# Altium schematic sheet USB-UART.SchDoc
size 420 x 297 mm; SheetNumber: 3; SheetTotal: 5; ProjectTitle: Prj name
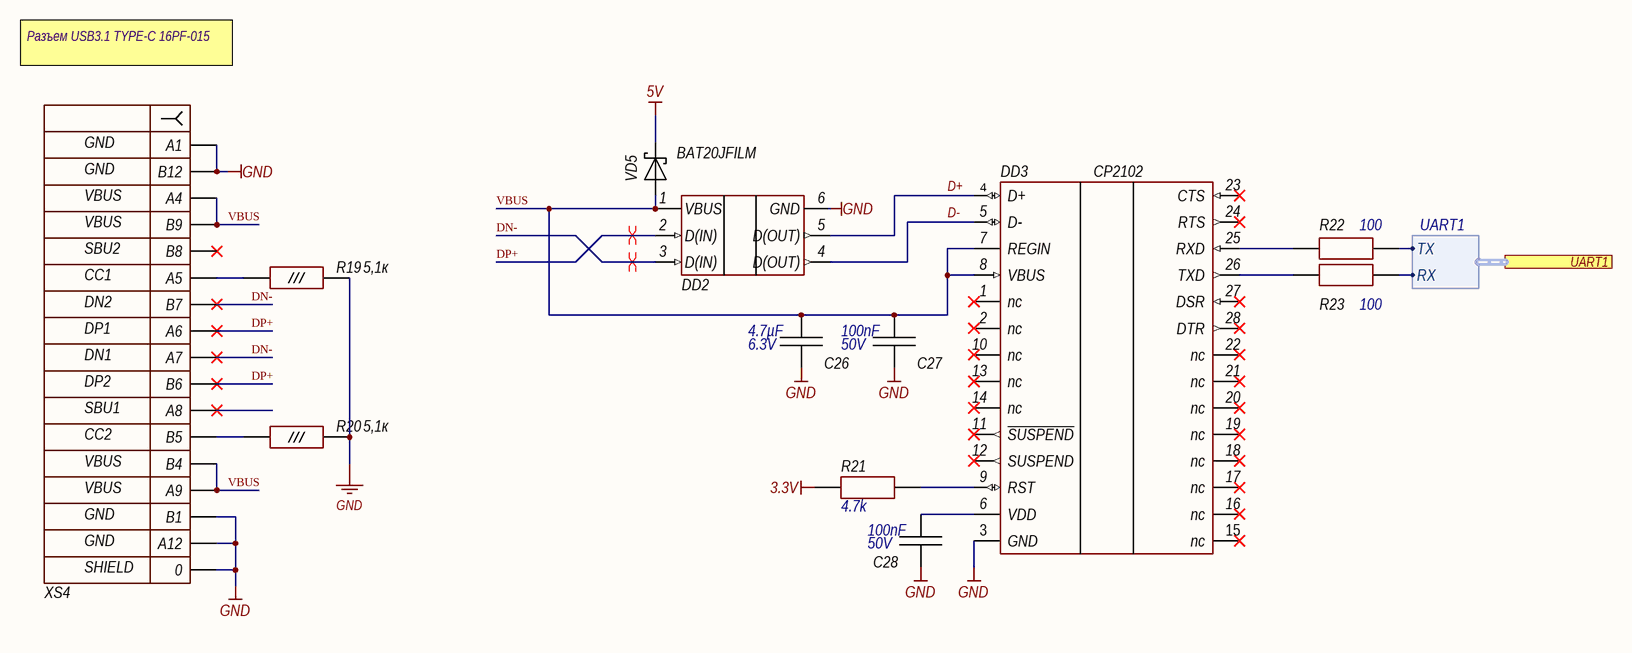
[diagram p0: USB-UART.SchDoc]

## Parts
C26  Voltage Rating: 6.3V  Capacitance: 4.7µF  [CAPC0603_H0.90_N]  (hidden comment: CC0603KRX7R5BB475)
C27  Capacitance: 100nF  Voltage Rating: 50V  [CAPC0603_H0.90_N]  (hidden comment: CC0603KRX7R7BB104)
C28  Capacitance: 100nF  Voltage Rating: 50V  [CAPC0603_H0.90_N]  (hidden comment: CC0603KRX7R7BB104)
DD2  STF202-22T1G  [TSOP-6]  (value not drawn)
DD3  CP2102  [QFN50P500X500X90_HS-29N]  (no BOM)
R19  5,1к  [RESC0402_N]
R20  5,1к  [RESC0402_N]
R21  Resistance: 4.7k  [RESC0603_N]  (hidden comment: RC0603FR-074K7L)
R22  Resistance: 100  [RESC0603_N]  (hidden comment: RC0603FR-07100RL)
R23  Resistance: 100  [RESC0603_N]  (hidden comment: RC0603FR-07100RL)
VD5  BAT20JFILM  [SOD-323]  (no BOM)
XS4  16pf-015  [XS_16PF-015]  (value not drawn)

## Ports
UART1 (harness UART1)

## Harnesses
UART1: RX, TX

## Nets
3.3V: R21.1
5V: VD5.2
GND: C26.2 C27.2 C28.2 DD2.6(GND) DD3.3(GND) R19.2 R20.2 XS4.0 XS4.1(A1) XS4.2(B12) XS4.15(B1) XS4.16(A12)
D+: DD2.5(D(OUT)) DD3.4(D+)
D-: DD2.4(D(OUT)) DD3.5(D-)
DN-: DD2.3(D(IN)) XS4.7(B7) XS4.9(A7)
DP+: DD2.2(D(IN)) XS4.8(A6) XS4.10(B6)
VBUS: C26.1 C27.1 DD2.1(VBUS) DD3.7(REGIN) DD3.8(VBUS) VD5.1 XS4.3(A4) XS4.4(B9) XS4.13(B4) XS4.14(A9)
NetC28_1: C28.1 DD3.6(VDD)
NetDD3_9: DD3.9(RST) R21.2
NetDD3_25: DD3.25(RXD) R22.1
NetDD3_26: DD3.26(TXD) R23.1
NetR19_1: R19.1 XS4.6(A5)
NetR20_1: R20.1 XS4.12(B5)
NetR22_2: R22.2 ; port UART1.TX
NetR23_2: R23.2 ; port UART1.RX

Not connected (* = marked no-connect by the designer): DD3 1(nc)* 2(nc)* 10(nc)* 11(~{SUSPEND})* 12(SUSPEND)* 13(nc)* 14(nc)* 15(nc)* 16(nc)* 17(nc)* 18(nc)* 19(nc)* 20(nc)* 21(nc)* 22(nc)* 23(CTS)* 24(RTS)* 27(DSR)* 28(DTR)*; XS4 5(B8)* 11(A8)*

## Layout directives
differential pair: DN-, DP+

## Notes on the sheet
- Разъем USB3.1 TYPE-C 16PF-015
- Title:
- Author:
- Approved:
- Size:
- Date:
- Git Hash:
- A3
- Prj:
- Sheet
- of
- SW Version:
- Variant:
- Edited:
- CONFIDENTIAL
- File:
- (in symbol CMP-CON-USB-0008-1) GND; VBUS; SBU2; CC1; DN2; DP1; DN1; DP2; SBU1; CC2; SHIELD

## Library data of the parts
C26 = CMP-CAP-CER-SMD-0033-1: 4.7uF 10% X7R 0603; Manufacturer: Yageo; Tolerance: 10%; Series: CC; Height: 800µm; Dielectric: X7R; Case Code (Metric): 1608; Length: 1.6mm; Case Code (Imperial): 0603; Max Operating Temperature: 125°C; Author: v.ivanchenko; Manufacturer Part Number: CC0603KRX7R5BB475; Min Operating Temperature: -55°C; Depth: 800µm; Lead Free: Lead Free; HelpURL: https://www.yageo.com/upload/media/product/products/datasheet/mlcc/UPY-GPHC_X7R_6.3V-to-50V_20.pdf; Case/Package: 0603
C27 C28 = CMP-CAP-CER-SMD-0036-1: 0.1uF 10% X7R 50V 0603; Manufacturer: Yageo; Length: 1.6mm; Min Operating Temperature: -55°C; Case Code (Metric): 1608; Case Code (Imperial): 0603; Author: v.ivanchenko; Tolerance: 10%; Case/Package: 0603; Depth: 800µm; Manufacturer Part Number: CC0603KRX7R7BB104; HelpURL: https://www.yageo.com/upload/media/product/products/datasheet/mlcc/UPY-GPHC_X7R_6.3V-to-50V_20.pdf; Max Operating Temperature: 125°C; Lead Free: Lead Free; Height: 800µm; Dielectric: X7R; Series: CC
DD2 = STF202-22T1G_ON Semiconductor: DD STF202-22T1G USB Filter with ESD protection; Voltage: 5,0 В; ValueBOM: Микросхема STF202-22T1G TSOP−6; Marking: S22; Автор: Коваль Максим; Количество1: 1; Цена1: 0.2926; Количество2: 2343; Цена2: 0.1986; Разрешен к применению: True; Type_BOM: Микросхема; HelpURL: https://www.onsemi.com/pub/Collateral/STF202-22T1-D.PDF; PartNumber: STF202-22T1G_ON Semiconductor; ManufacturerPartNumber: STF202-22T1G; Manufacturer: ON Semiconductor; Value: STF202-22T1G; ComponentLink3Description: Datasheet; Modify: 14.01.2019 15:51:31; Supplier: Compel; Supplier P/N: STF202-22T1G; Package: TSOP-6; ВП: Микросхема STF202-22T1G TSOP−6; ComponentLink4URL: https://sds.compel.ru/search?q=STF202-22T1G; ComponentLink5URL: https://www.chipdip.by/search?searchtext=STF202-22T1G; ComponentLink6URL: https://belchip.by/search_fuzzy/?query=STF202-22T1G; ComponentLink4Description: Compel; ComponentLink5Description: Chip-Dip; ComponentLink6Description: Belchip; Package_BOM: TSOP-6; Package Description: TSOP-6; SMD mounting: True; ComponentLink1Description: Supplier; ComponentLink1URL: http://www.compel.ru; ComponentLink2Description: Manufacturer Link; ComponentLink2URL: http://www.onsemi.ru.com/; Type: DD
DD3 = CP2102_Silicon Labs: DD CP2102 SINGLE-CHIP USB-TO-UART BRIDGE; ValueBOM: Микросхема  CP2102; Автор: Касперович Андрей; Количество1: 1; Цена1: 3.2; Количество2: 10000; Цена2: 2.95; Разрешен к применению: True; Package_BOM: QFN28; Type_BOM: Микросхема; HelpURL: https://www.silabs.com/documents/public/data-sheets/CP2102-9.pdf; PartNumber: CP2102_Silicon Labs; ManufacturerPartNumber: CP2102; Manufacturer: Silicon Labs; Value: CP2102; ComponentLink3Description: Datasheet; Modify: 20.11.2018 8:18:00; Supplier: Compel; Package: QFN50P500X500X90_HS-29N; ВП: Микросхема  CP2102; ComponentLink4URL: https://sds.compel.ru/search?q=CP2102; ComponentLink5URL: https://www.chipdip.by/search?searchtext=CP2102; ComponentLink6URL: https://belchip.by/search_fuzzy/?query=CP2102; ComponentLink4Description: Compel; ComponentLink5Description: Chip-Dip; ComponentLink6Description: Belchip; Package Description: QFN50P500X500X90_HS-29N; SMD mounting: True; ComponentLink1Description: Supplier; ComponentLink1URL: http://www.compel.ru; ComponentLink2Description: Manufacturer Link; ComponentLink2URL: http://www.silabs.com/; Type: DD
R19 R20 = RC0402FR-075K1L_Yageo: RES 5k1 SMD 0402 1%; Manufacturer: Yageo; Power: 0,1 Вт; ValueBOM: Резистор RC0402FR-075K1L "Yageo" (5,1 кОм ± 1 %, 0,1 Вт SMD 0402); ТКС: ±100ppm/C°; Автор: Анципов Антон; Количество1: 1; Цена1: 0,0011; Количество2: 50000; Цена2: 0,0010; Разрешен к применению: True; Type_BOM: Резистор; PartNumber: RC0402FR-075K1L_Yageo; HelpURL: http://www.yageo.com/documents/recent/PYu-RC0402_51_RoHS_L_6.pdf; ManufacturerPartNumber: RC0402FR-075K1L; ComponentLink3Description: Datasheet; Value: 5,1к; Tolerance: ± 1 %; ComponentLink2Description: Manufacturer Link; ComponentLink2URL: http://www.yageo.com/; Operating Temperature: -55°C ~ +155°C; Modify: 09.02.2021 18:51:35; Supplier: Compel; Supplier P/N: RC0402FR-075K1L; Package Description: SMD 0402; Package: RESC0402; Type: R; ComponentLink4URL: https://sds.compel.ru/search?q=RC0402FR-075K1L; ComponentLink5URL: https://www.chipdip.by/search?searchtext=RC0402FR-075K1L; ComponentLink6URL: https://belchip.by/search_fuzzy/?query=RC0402FR-075K1L; ComponentLink4Description: Compel; ComponentLink5Description: Chip-Dip; ComponentLink6Description: Belchip; Package_BOM: SMD 0402
R21 = CMP-RES-SMD-0429-2: RES SMD 4,7 KOHM 1% 1/10W 0603; Manufacturer: Yageo; Max Power Dissipation: 100mW; Temperature Coefficient: ±100ppm/C°; Voltage Rating: 75V; Author: M.S. Koval; Case/Package: 0603; HelpURL: https://www.yageo.com/upload/media/product/productsearch/datasheet/rchip/PYu-RC_Group_51_RoHS_L_11.pdf; Manufacturer Part Number: RC0603FR-074K7L; Max Operating Temperature: 155°C; Min Operating Temperature: -55°C; Tolerance: 1%
R22 R23 = CMP-RES-SMD-0389-2: RES SMD 100 OHM 1% 1/10W 0603; Manufacturer: Yageo; Max Power Dissipation: 100mW; Temperature Coefficient: ±100ppm/C°; Voltage Rating: 75V; Author: M.S. Koval; Case/Package: 0603; HelpURL: https://www.yageo.com/upload/media/product/productsearch/datasheet/rchip/PYu-RC_Group_51_RoHS_L_11.pdf; Manufacturer Part Number: RC0603FR-07100RL; Max Operating Temperature: 155°C; Min Operating Temperature: -55°C; Tolerance: 1%
VD5 = BAT20JFILM_STMicroelectronics: DIODE SCHOTTKY 23V 1A; Voltage: 23 В; Current: 1 А; ValueBOM: Диод BAT20JFILM "STMicroelectronics" SOD-323; Marking: 20; Автор: Селедцов Михаил; Количество1: 1; Цена1: 0.32; Количество2: 1000; Цена2: 0.0612; Разрешен к применению: True; ВП: Диод BAT20JFILM SOD-323; Type: VD; Type_BOM: Диод; HelpURL: https://www.st.com/resource/en/datasheet/bat20j.pdf; PartNumber: BAT20JFILM_STMicroelectronics; ManufacturerPartNumber: BAT20JFILM; Manufacturer: STMicroelectronics; Value: BAT20JFILM; Operating Temperature: -65°C ~ +150°C; ComponentLink3Description: Datasheet; Modify: 26.03.2020 17:26:51; Supplier: Digi-Key; Supplier P/N: 497-3381-1-ND; Package: SOD-323; ComponentLink4URL: https://www.digikey.com/product-detail/en/stmicroelectronics/BAT20JFILM/497-3381-1-ND/669138; ComponentLink5URL: https://www.chipdip.by/search?searchtext=STPS0560Z; ComponentLink6URL: https://sds.compel.ru/infosheet/ST/BAT20JFILM; ComponentLink4Description: Digi-Key; ComponentLink5Description: Chip-Dip; ComponentLink6Description: Compel; Package_BOM: SOD-323; Package Description: SOD-323; SMD mounting: True; ComponentLink1Description: Supplier; ComponentLink1URL: http://www.digikey.com; ComponentLink2Description: Manufacturer Link; ComponentLink2URL: http://www.st.com
XS4 = CMP-CON-USB-0008-1: USB3.1 TYPEC 16P SMD RA; Manufacturer: JAE; Gender: Female; Current Rating: 5A; USB Standard: USB 3.2; Number of Ports: 1; USB Type: Type-C; Mating Cycles: 10000; Height: 1.57mm; Author: V.O.Ivanchenko; HelpURL: https://www.jae.com/en/connectors/series/detail/product/id=66509; Orientation: Horizontal; Min Operating Temperature: -40°C; Manufacturer Part Number: 16pf-015; Mount: Surface Mount; Max Operating Temperature: 85°C